# EAGLE design TUGAS DAY0 (EAGLE 7.3.0)
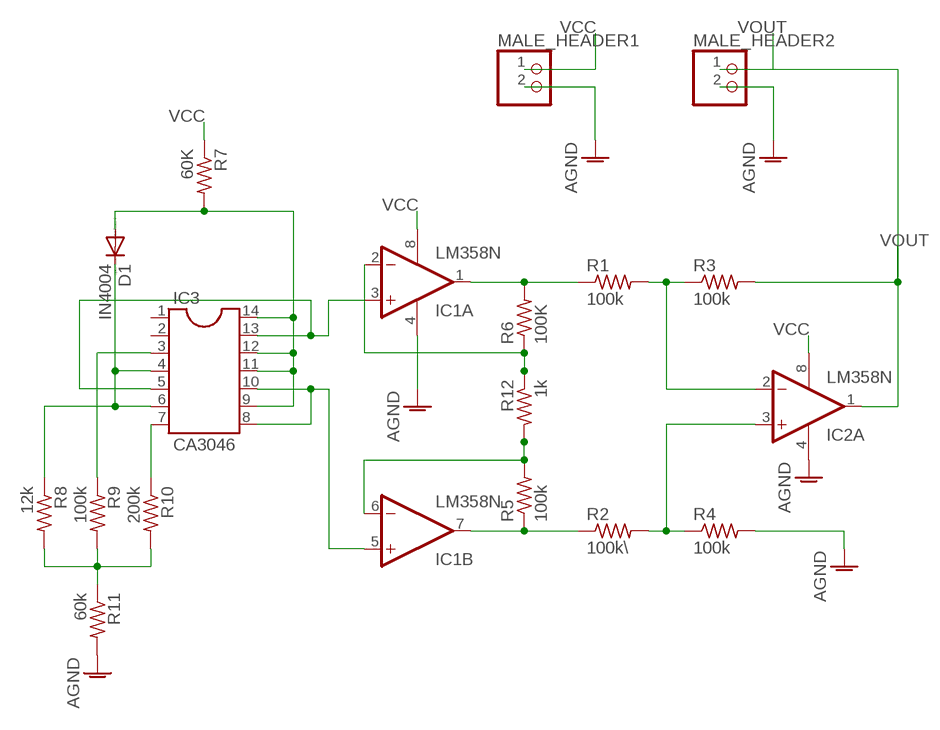
[diagram p0: schematic, sheet 1]

## Parts
D1  IN4004  DIODE-D-7.5  [D-7.5]
IC1  LM358N  [DIL08]
IC2  LM358N  [DIL08]
IC3  CA3046  DIL14  [DIL14]
MALE_HEADER1  PINHD-1X2  [1X02]
MALE_HEADER2  PINHD-1X2  [1X02]
R1  100k  R-US_0207/7  [0207/7]
R2  100k\  R-US_0207/7  [0207/7]
R3  100k  R-US_0207/7  [0207/7]
R4  100k  R-US_0207/7  [0207/7]
R5  100k  R-US_0207/7  [0207/7]
R6  100K  R-US_0207/7  [0207/7]
R7  60K  R-US_0207/7  [0207/7]
R8  12k  R-US_0207/7  [0207/7]
R9  100k  R-US_0207/7  [0207/7]
R10  200k  R-US_0207/7  [0207/7]
R11  60k  R-US_0207/7  [0207/7]
R12  1k  R-US_0207/7  [0207/7]

## Nets
AGND: IC1.4(P:V-) IC2.4(P:V-) MALE_HEADER1.2 MALE_HEADER2.2 R4.2 R11.2
N$1: IC1.6(B:-IN) R5.2 R12.2
N$2: D1.A IC3.9 IC3.11 IC3.12 IC3.14 R7.2
N$3: R8.2 R9.2 R10.2 R11.1
N$4: IC3.7 R10.1
N$5: IC3.3 R9.1
N$6: D1.C IC3.4 IC3.6 R8.1
N$7: IC1.3(A:+IN) IC3.5 IC3.13
N$8: IC1.5(B:+IN) IC3.8 IC3.10
N$10: IC1.1(A:OUT) R1.1 R6.2
N$13: IC1.2(A:-IN) R6.1 R12.1
N$14: IC1.7(B:OUT) R2.1 R5.1
N$15: IC2.3(A:+IN) R2.2 R4.1
N$16: IC2.2(A:-IN) R1.2 R3.1
VCC: IC1.8(P:V+) IC2.8(P:V+) MALE_HEADER1.1 R7.1
VOUT: IC2.1(A:OUT) MALE_HEADER2.1 R3.2
Unconnected: IC2.5(B:+IN) IC2.6(B:-IN) IC2.7(B:OUT) IC3.1 IC3.2

## Library data of the parts
D1 = diode:DIODE-: DIODE
IC1 IC2 = linear:LM358: OP AMP also LM158; LM258; LM2904 Source: http://cache.national.com/ds/LM/LM158.pdf
IC3 = ic-package:DIL14: Dual In Line / Socket
MALE_HEADER1 MALE_HEADER2 = pinhead:PINHD-1X2: PIN HEADER
R1-R12 = resistor:R-US_: RESISTOR, American symbol

## Board
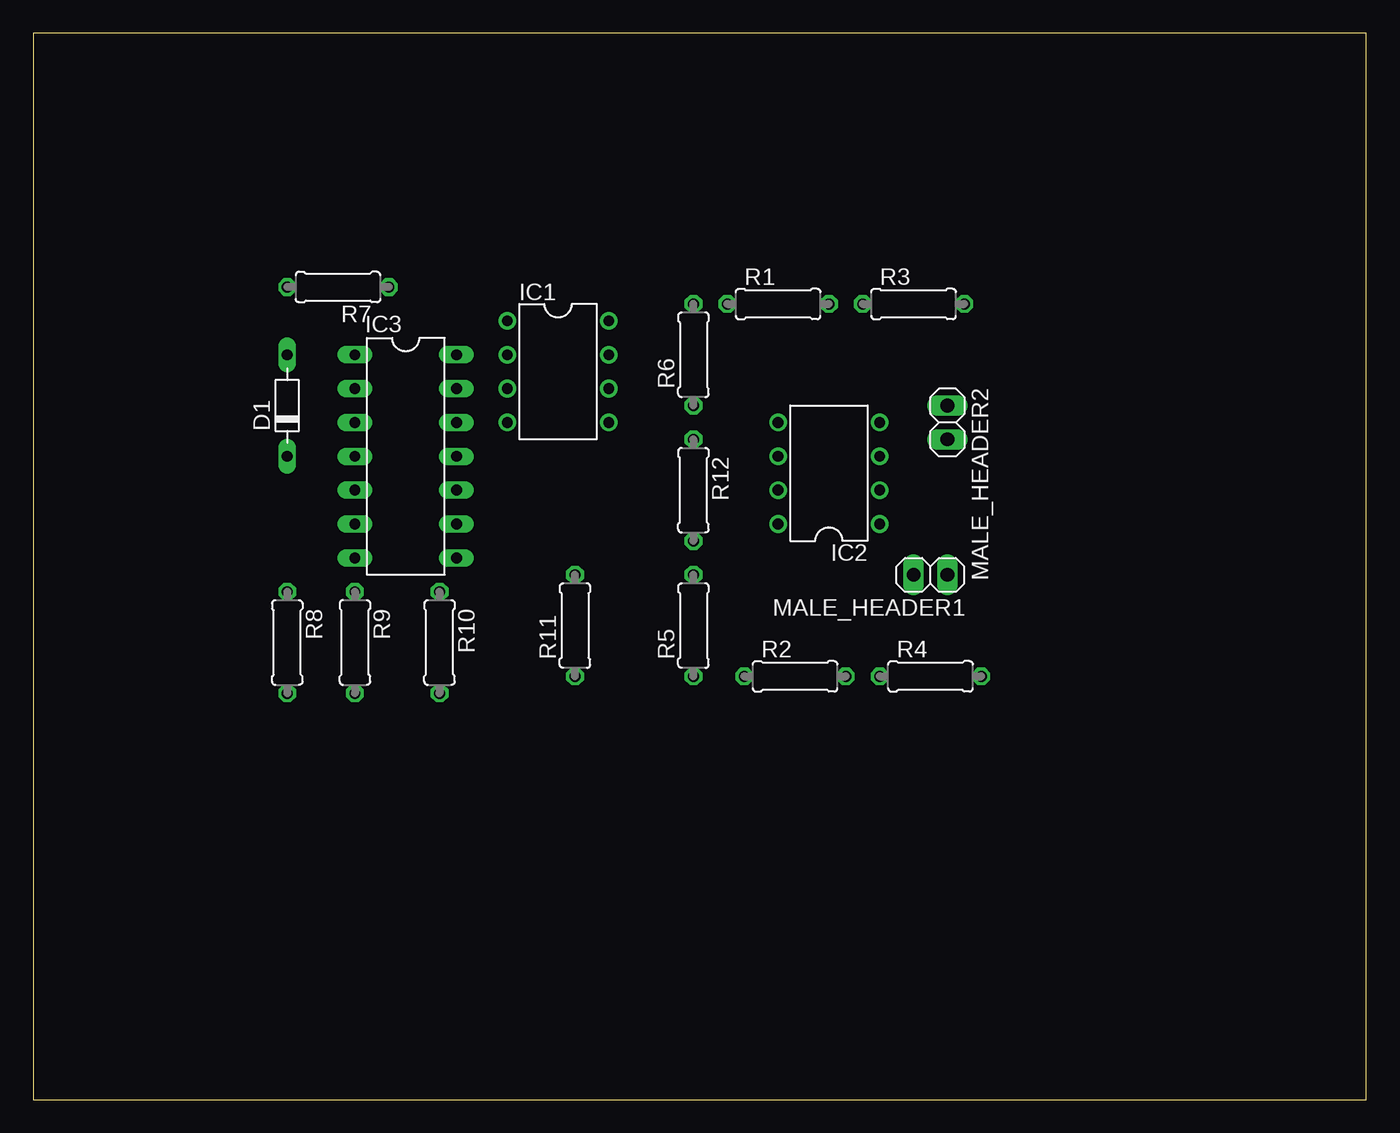
[diagram p1: board, top side]
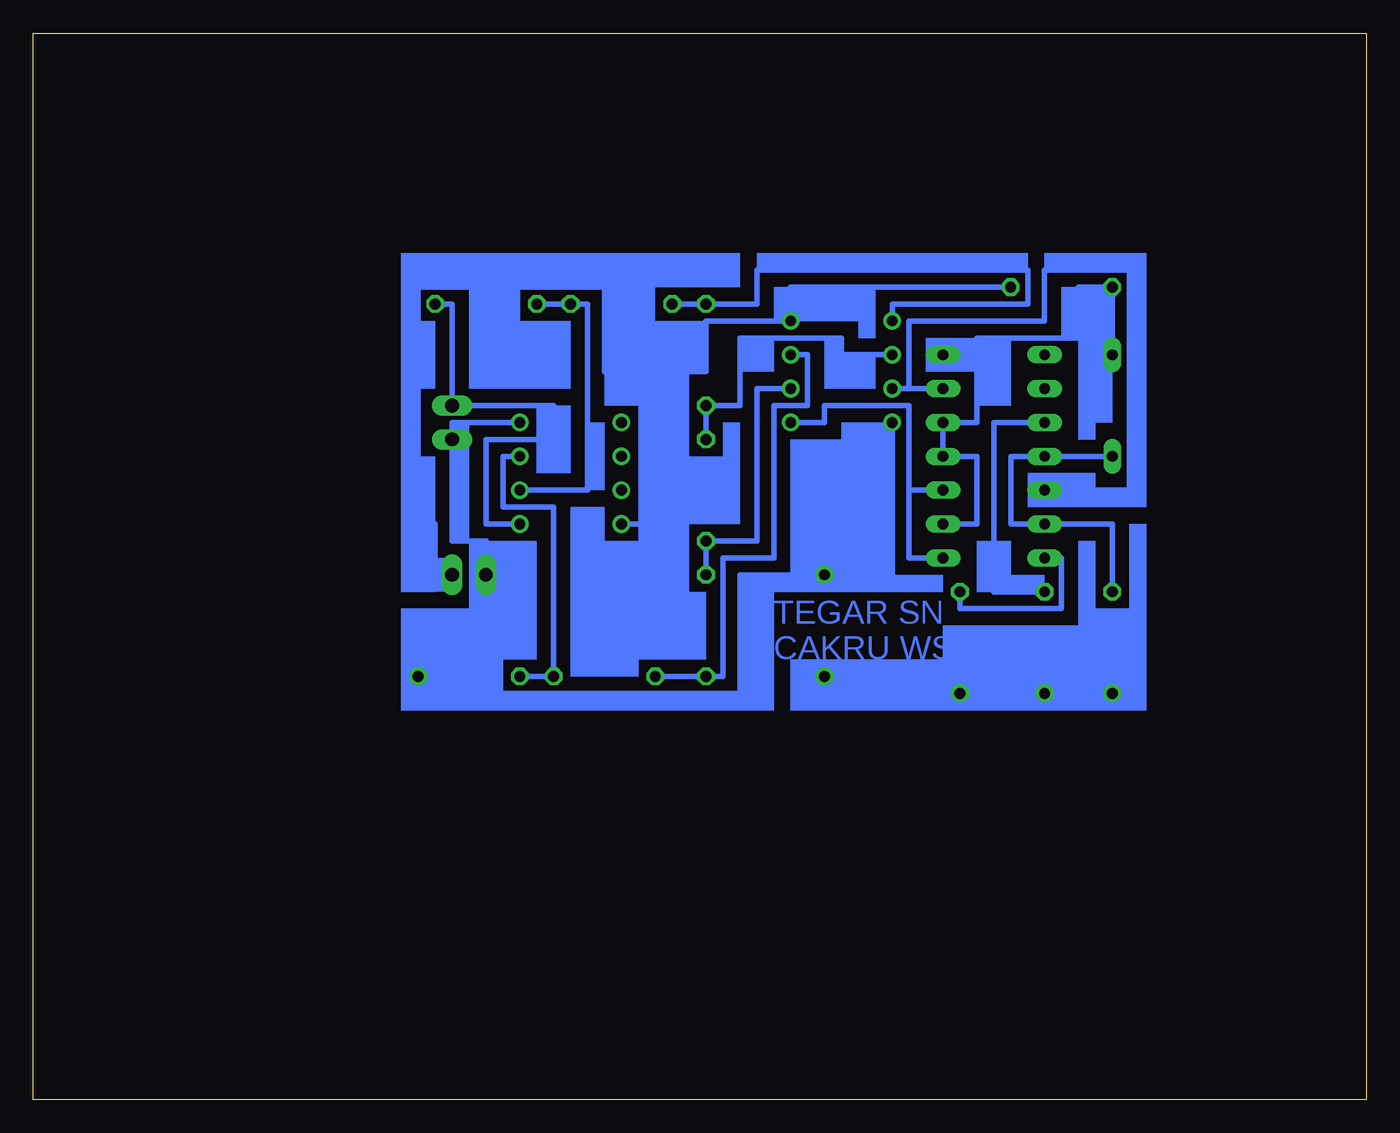
[diagram p2: board, bottom side, seen from below]

Size 100 x 80 mm. Coordinates in mm from the lower left corner, seen from the top.
Outline: 0,0 100,0 100,80 0,80 0,0
Copper layers (1*16): Top 0.035mm / dielectric 1.5mm / Bottom 0.035mm
Design rules "default": minimum track width 10mil, minimum drill 24mil, track to track 8mil, track to pad 8mil, pad to pad 8mil, via to via 8mil, smd to smd 8mil, copper to edge 40mil, drill to drill 8mil, minimum pad ring 10mil, minimum via ring 8mil, stop-mask expansion 4mil, vias tented up to drill 0mil, thermal gap 10mil

### Footprints (pad centres in the part's own frame; a part is rotated, then mirrored left to right if it is on the bottom)
D-7.5 = drill 0.813 long: A 3.81,0; C -3.81,0
DIL08 = drill 0.813 pad 1.27: 1 -3.81,-3.81; 2 -1.27,-3.81; 3 1.27,-3.81; 4 3.81,-3.81; 5 3.81,3.81; 6 1.27,3.81; 7 -1.27,3.81; 8 -3.81,3.81
DIL14 = drill 0.813 long: 1 -7.62,-3.81; 2 -5.08,-3.81; 3 -2.54,-3.81; 4 0,-3.81; 5 2.54,-3.81; 6 5.08,-3.81; 7 7.62,-3.81; 8 7.62,3.81; 9 5.08,3.81; 10 2.54,3.81; 11 0,3.81; 12 -2.54,3.81; 13 -5.08,3.81; 14 -7.62,3.81
1X02 = drill 1.016 long: 1 -1.27,0; 2 1.27,0
0207/7 = drill 0.813 octagon: 1 -3.81,0; 2 3.81,0

### Placement (x,y rotation side)
D1  19.05,52.07 90 top
IC1  39.37,54.61 270 top
IC2  59.69,46.99 90 top
IC3  27.94,48.26 270 top
MALE_HEADER1  67.31,39.37 180 top
MALE_HEADER2  68.58,50.8 270 top
R1  55.88,59.69 0 top
R2  57.15,31.75 0 top
R3  66.04,59.69 0 top
R4  67.31,31.75 0 top
R5  49.53,35.56 90 top
R6  49.53,55.88 90 top
R7  22.86,60.96 180 top
R8  19.05,34.29 270 top
R9  24.13,34.29 270 top
R10  30.48,34.29 270 top
R11  40.64,35.56 90 top
R12  49.53,45.72 270 top

### Tracks (layer width: path | path; a pad name or v marks a point on that pad's centre or on a via)
AGND
  Bottom 0.406: IC1.4 35.56,39.37 R11.2 46.99,39.37 46.99,30.48 68.58,30.48 68.58,31.75 | 68.58,31.75 R4.2 | IC2.4 68.58,50.8 MALE_HEADER2.2 68.58,41.91 66.04,41.91 MALE_HEADER1.2 66.04,35.56 68.58,35.56 68.58,31.75
N$1
  Bottom 0.406: R5.2 R12.2 45.72,41.91 45.72,53.34 IC1.6
N$2
  Bottom 0.406: D1.A R7.2 21.59,60.96 21.59,57.15 29.21,57.15 29.21,55.88 | 29.21,55.88 IC3.14 | IC3.9 29.21,43.18 29.21,48.26 IC3.11 IC3.12 29.21,50.8 29.21,55.88
N$3
  Bottom 0.406: R8.2 R9.2 R10.2 40.64,30.48 R11.1
N$4
  Bottom 0.406: IC3.7 22.86,40.64 22.86,36.83 30.48,36.83 R10.1
N$5
  Bottom 0.406: IC3.3 27.94,50.8 27.94,38.1 R9.1
N$6
  Bottom 0.406: D1.C IC3.4 26.67,48.26 26.67,43.18 IC3.6 19.05,43.18 R8.1
N$7
  Bottom 0.406: IC3.5 17.78,45.72 17.78,62.23 24.13,62.23 24.13,58.42 34.29,58.42 34.29,53.34 IC3.13 IC1.3
N$8
  Bottom 0.406: IC3.8 34.29,40.64 34.29,45.72 | IC3.10 34.29,45.72 | 34.29,45.72 34.29,52.07 40.64,52.07 40.64,50.8 IC1.5
N$10
  Bottom 0.406: R1.1 R6.2 45.72,59.69 45.72,62.23 25.4,62.23 25.4,59.69 35.56,59.69 IC1.1
N$13
  Bottom 0.406: R12.1 R6.1 46.99,52.07 46.99,57.15 39.37,57.15 39.37,55.88 IC1.2
N$14
  Bottom 0.406: R2.1 R5.1 48.26,31.75 48.26,40.64 44.45,40.64 44.45,52.07 41.91,52.07 41.91,55.88 IC1.7
N$15
  Bottom 0.406: R4.1 R2.2 60.96,44.45 64.77,44.45 64.77,48.26 IC2.3
N$16
  Bottom 0.406: R1.2 R3.1 58.42,59.69 58.42,45.72 IC2.2
VCC
  Bottom 0.406: R7.1 43.18,60.96 IC1.8 49.53,58.42 49.53,54.61 52.07,54.61 | IC2.8 52.07,43.18 52.07,54.61 | 52.07,54.61 57.15,54.61 57.15,60.96 71.12,60.96 71.12,43.18 69.85,43.18 69.85,39.37 MALE_HEADER1.1
VOUT
  Bottom 0.406: R3.2 68.58,59.69 MALE_HEADER2.1 60.96,52.07 60.96,49.53 66.04,49.53 66.04,43.18 IC2.1
(copper drawn outside any net)
  shapes: Bottom area x59

### Text on the board
Bottom: TEGAR SN / CAKRU WS